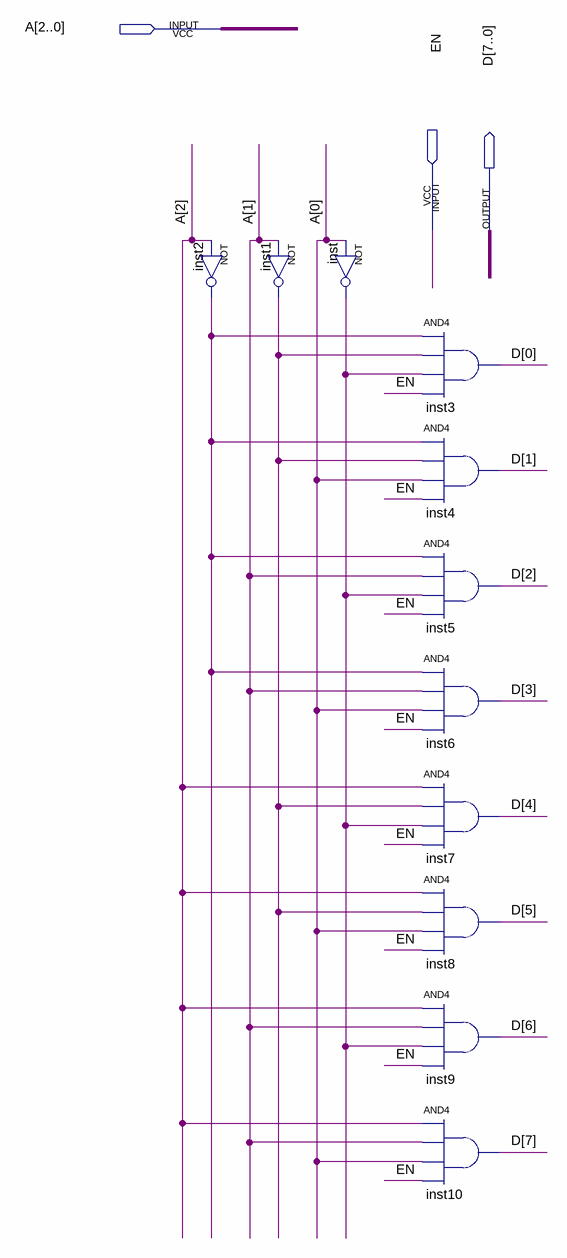
[diagram p0: schematic sheet]
// Quartus schematic 3to8_en.bdf as structural Verilog: 11 symbols, 3 pins
module \3to8_en  (
  input  [2:0] A,
  input  EN,
  output [7:0] D
);

  wire inst1_out, inst2_out, inst_out;

  not inst2 (inst2_out, A[2]);
  not inst1 (inst1_out, A[1]);
  not inst (inst_out, A[0]);
  and inst3 (D[0], inst2_out, inst1_out, inst_out, EN);
  and inst4 (D[1], inst2_out, inst1_out, A[0], EN);
  and inst5 (D[2], inst2_out, A[1], inst_out, EN);
  and inst6 (D[3], inst2_out, A[1], A[0], EN);
  and inst7 (D[4], A[2], inst1_out, inst_out, EN);
  and inst8 (D[5], A[2], inst1_out, A[0], EN);
  and inst9 (D[6], A[2], A[1], inst_out, EN);
  and inst10 (D[7], A[2], A[1], A[0], EN);
endmodule
